# Altium project McGill_Robotics_Rover_MainShieldBoard.PrjPcb
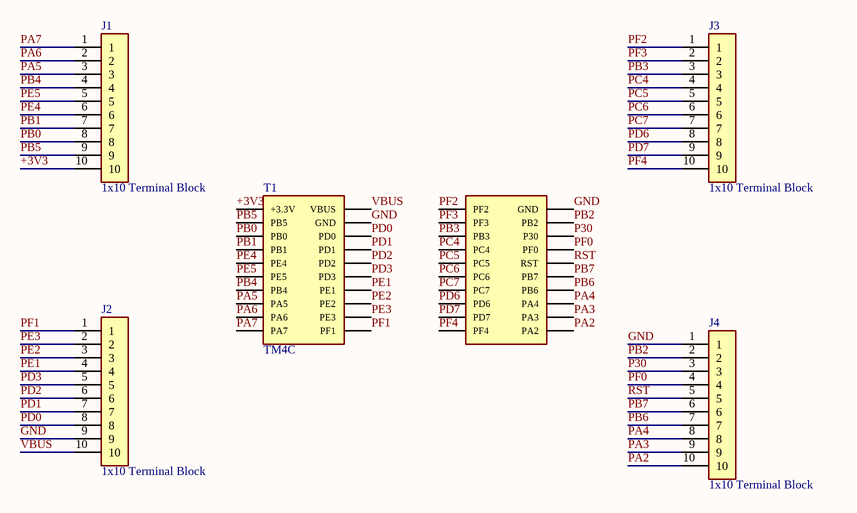
[diagram p0: Main Shield Board.SchDoc]
1 sheet, 5 parts. Net scope: global (net labels, ports and power ports of the same name join across sheets).
Board file: Main Shield Board.PcbDoc

## Sheet Main Shield Board.SchDoc
size A4; SheetNumber: 1; SheetTotal: 1

### Parts
J1  1x10 Terminal Block  [PHOENIX_1988888]
J2  1x10 Terminal Block  [PHOENIX_1988888]
J3  1x10 Terminal Block  [PHOENIX_1988888]
J4  1x10 Terminal Block  [PHOENIX_1988888]
T1  TM4C  [SAMTEC_TSW-110-23-S-D]

### Nets
+3V3: J1.10 T1.+3.3V
GND: J2.9 J4.1 T1.GND
P30: J4.3 T1.P30
PA2: J4.10 T1.PA2
PA3: J4.9 T1.PA3
PA4: J4.8 T1.PA4
PA5: J1.3 T1.PA5
PA6: J1.2 T1.PA6
PA7: J1.1 T1.PA7
PB0: J1.8 T1.PB0
PB1: J1.7 T1.PB1
PB2: J4.2 T1.PB2
PB3: J3.3 T1.PB3
PB4: J1.4 T1.PB4
PB5: J1.9 T1.PB5
PB6: J4.7 T1.PB6
PB7: J4.6 T1.PB7
PC4: J3.4 T1.PC4
PC5: J3.5 T1.PC5
PC6: J3.6 T1.PC6
PC7: J3.7 T1.PC7
PD0: J2.8 T1.PD0
PD1: J2.7 T1.PD1
PD2: J2.6 T1.PD2
PD3: J2.5 T1.PD3
PD6: J3.8 T1.PD6
PD7: J3.9 T1.PD7
PE1: J2.4 T1.PE1
PE2: J2.3 T1.PE2
PE3: J2.2 T1.PE3
PE4: J1.6 T1.PE4
PE5: J1.5 T1.PE5
PF0: J4.4 T1.PF0
PF1: J2.1 T1.PF1
PF2: J3.1 T1.PF2
PF3: J3.2 T1.PF3
PF4: J3.10 T1.PF4
RST: J4.5 T1.RST
VBUS: J2.10 T1.VBUS

### Library data of the parts
J1-J4 = 1988888: Conn PC Terminal Block 10 POS 5mm Solder Thru-Hole 17.5A; Manufacturer: Phoenix Contact; Number of Positions: 10; Current Rating: 24A; Voltage Rating: 250V; Number of Levels: 1; Current: 15A; Voltage: 300V; Wire Gauge (Max): 26AWG; Wire Gauge (Min): 12AWG; Approvals: UL,VDE,CB,EAC; Supplier 1: Digi-Key; Supplier Part Number 1: 277-1772-ND; Manufacturer Part Number: 1988888; RoHS: Yes; Category: Terminal Blocks; Stock 1: 781; Pricing 1: 1=2.29000, 10=2.18900, 50=2.12940, 100=1.99000, 250=1.89448 (USD); Mount: Through Hole; Weight: 0.358383oz; Color: Green; Housing Color: Green; Housing Material: Nylon; Number of Rows: 1; Package Quantity: 100; Packaging: Bulk; Series: COMBICON PTA; Max Current Rating: 17.5A; Number of Positions Per Level: 10; Termination: Screw; Number of Contacts: 10; Number of Circuits: 10; Number of Poles: 10; Length: 50mm; Width: 12.8mm; Height: 11.9mm; Pitch: 5mm; RoHS Compliant: Yes; Lead Free: Lead Free; Flammability Rating: UL94 V-0; ComponentLink1URL: https://datasheet.ciiva.com/16051/1988888-16051357.pdf?src-supplier=Onlinecomponents.com; ComponentLink1Description: https://datasheet.ciiva.com/16051/1988888-16051357.pdf?src-supplier=Onlinecomponents.com; ComponentLink2URL: https://datasheet.ciiva.com/824/combiconcompact5-0mmseries-824318.pdf?src-supplier=Digi-Key; ComponentLink2Description: https://datasheet.ciiva.com/824/combiconcompact5-0mmseries-824318.pdf?src-supplier=Digi-Key